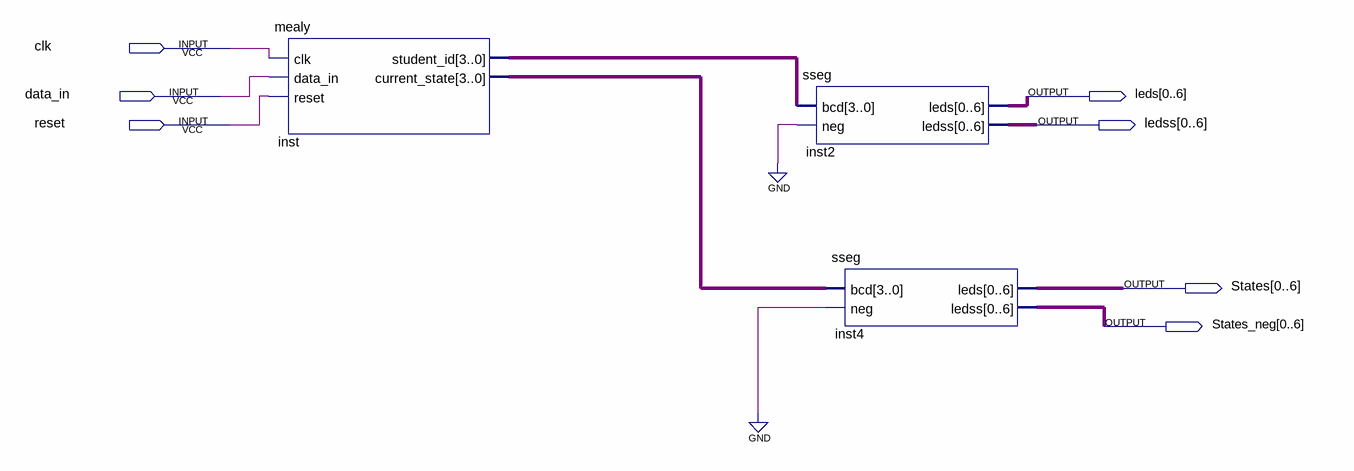
[diagram p0: schematic sheet]
// Quartus schematic blockMealy.bdf as structural Verilog: 3 symbols, 7 pins
module blockMealy (
  input  clk,
  input  data_in,
  input  reset,
  output [0:6] leds,
  output [0:6] ledss,
  output [0:6] States,
  output [0:6] States_neg
);

  wire [3:0] inst_current_state, inst_student_id;

  mealy inst (
    .clk(clk), .data_in(data_in), .reset(reset), .student_id(inst_student_id),
    .current_state(inst_current_state));
  sseg inst2 (.bcd(inst_student_id), .neg(1'b0), .leds(leds), .ledss(ledss));
  sseg inst4 (.bcd(inst_current_state), .neg(1'b0), .leds(States), .ledss(States_neg));
endmodule
